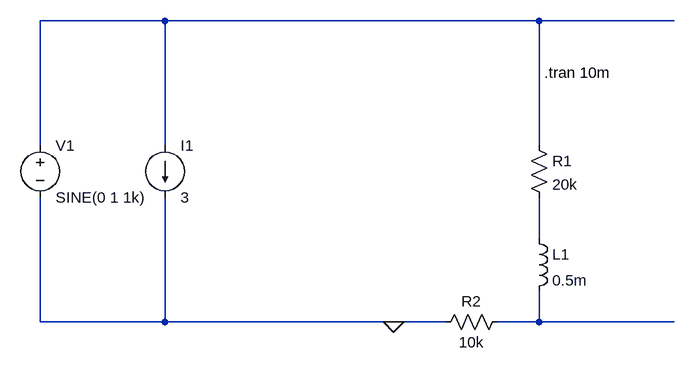
[diagram p0: schematic TRAN_V-Sine_I-DC_R+L.asc]
TRAN_V-Sine_I-DC_R+L.asc, the LTspice schematic file:
Version 4
SHEET 1 880 680
WIRE 64 64 -128 64
WIRE 640 64 64 64
WIRE 848 64 640 64
WIRE -128 256 -128 64
WIRE 64 256 64 64
WIRE 640 256 640 64
WIRE 640 400 640 336
WIRE -128 528 -128 336
WIRE 64 528 64 336
WIRE 64 528 -128 528
WIRE 416 528 64 528
WIRE 496 528 416 528
WIRE 640 528 640 480
WIRE 640 528 576 528
WIRE 848 528 640 528
FLAG 416 528 0
SYMBOL voltage -128 240 R0
SYMATTR InstName V1
SYMATTR Value SINE(0 1 1k)
SYMBOL res 624 240 R0
SYMATTR InstName R1
SYMATTR Value 20k
SYMBOL current 64 256 R0
SYMATTR InstName I1
SYMATTR Value 3
SYMBOL ind 624 384 R0
SYMATTR InstName L1
SYMATTR Value 0.5m
SYMBOL res 592 512 R90
WINDOW 0 0 56 VBottom 2
WINDOW 3 32 56 VTop 2
SYMATTR InstName R2
SYMATTR Value 10k
TEXT 648 144 Left 2 !.tran 10m

The netlist it stands for:
* TRAN_V-Sine_I-DC_R+L.asc
V1 N001 0 SINE(0 1 1k)
R1 N001 N002 20k
I1 N001 0 3
L1 N002 N003 0.5m
R2 N003 0 10k
.tran 10m
.backanno
.end